# EAGLE schematic VALVE BREAKOUT (EAGLE 7.6.0)
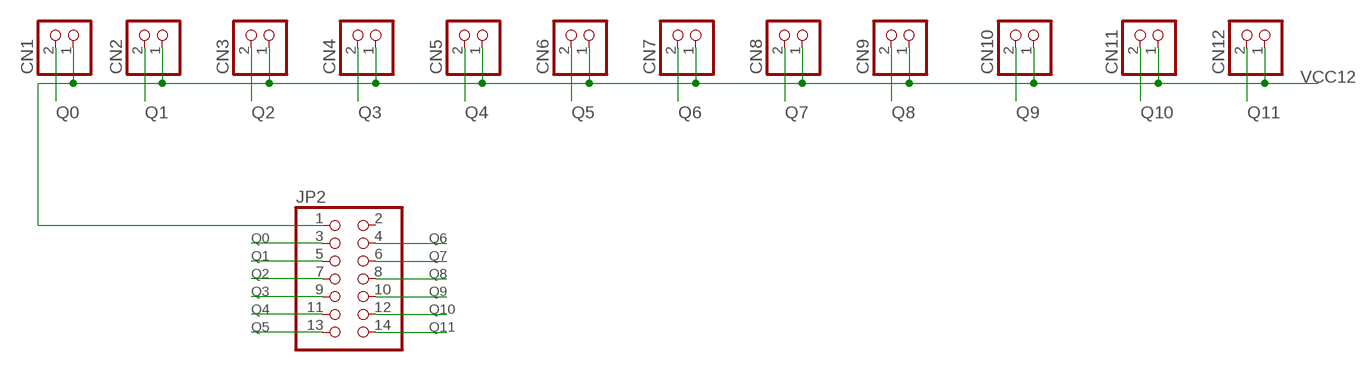
[diagram p0: schematic, sheet 1]

## Parts
CN1  JST_2PIN-THM  [JST-PH-2-THM]
CN2  JST_2PIN-THM  [JST-PH-2-THM]
CN3  JST_2PIN-THM  [JST-PH-2-THM]
CN4  JST_2PIN-THM  [JST-PH-2-THM]
CN5  JST_2PIN-THM  [JST-PH-2-THM]
CN6  JST_2PIN-THM  [JST-PH-2-THM]
CN7  JST_2PIN-THM  [JST-PH-2-THM]
CN8  JST_2PIN-THM  [JST-PH-2-THM]
CN9  JST_2PIN-THM  [JST-PH-2-THM]
CN10  JST_2PIN-THM  [JST-PH-2-THM]
CN11  JST_2PIN-THM  [JST-PH-2-THM]
CN12  JST_2PIN-THM  [JST-PH-2-THM]
JP2  PINHD-2X7  [2X07]

## Nets
Q0: CN1.2 JP2.3
Q1: CN2.2 JP2.5
Q2: CN3.2 JP2.7
Q3: CN4.2 JP2.9
Q4: CN5.2 JP2.11
Q5: CN6.2 JP2.13
Q6: CN7.2 JP2.4
Q7: CN8.2 JP2.6
Q8: CN9.2 JP2.8
Q9: CN10.2 JP2.10
Q10: CN11.2 JP2.12
Q11: CN12.2 JP2.14
VCC12: CN1.1 CN2.1 CN3.1 CN4.1 CN5.1 CN6.1 CN7.1 CN8.1 CN9.1 CN10.1 CN11.1 CN12.1 JP2.1
Unconnected: JP2.2

## Library data of the parts
CN1-CN12 = adafruit:JST_2PIN: JST 2-Pin Connectors of various flavors SMT-RA (S2B-PH-SM4) 4UConnector #17311 SMT (B2B-PH-SM4) THM-RA (S2B-PH) THM (B2B-PH)
JP2 = pinhead:PINHD-2X7: PIN HEADER